# Altium project QUTMS-SHDN-CURRENT-V00.PrjPcb
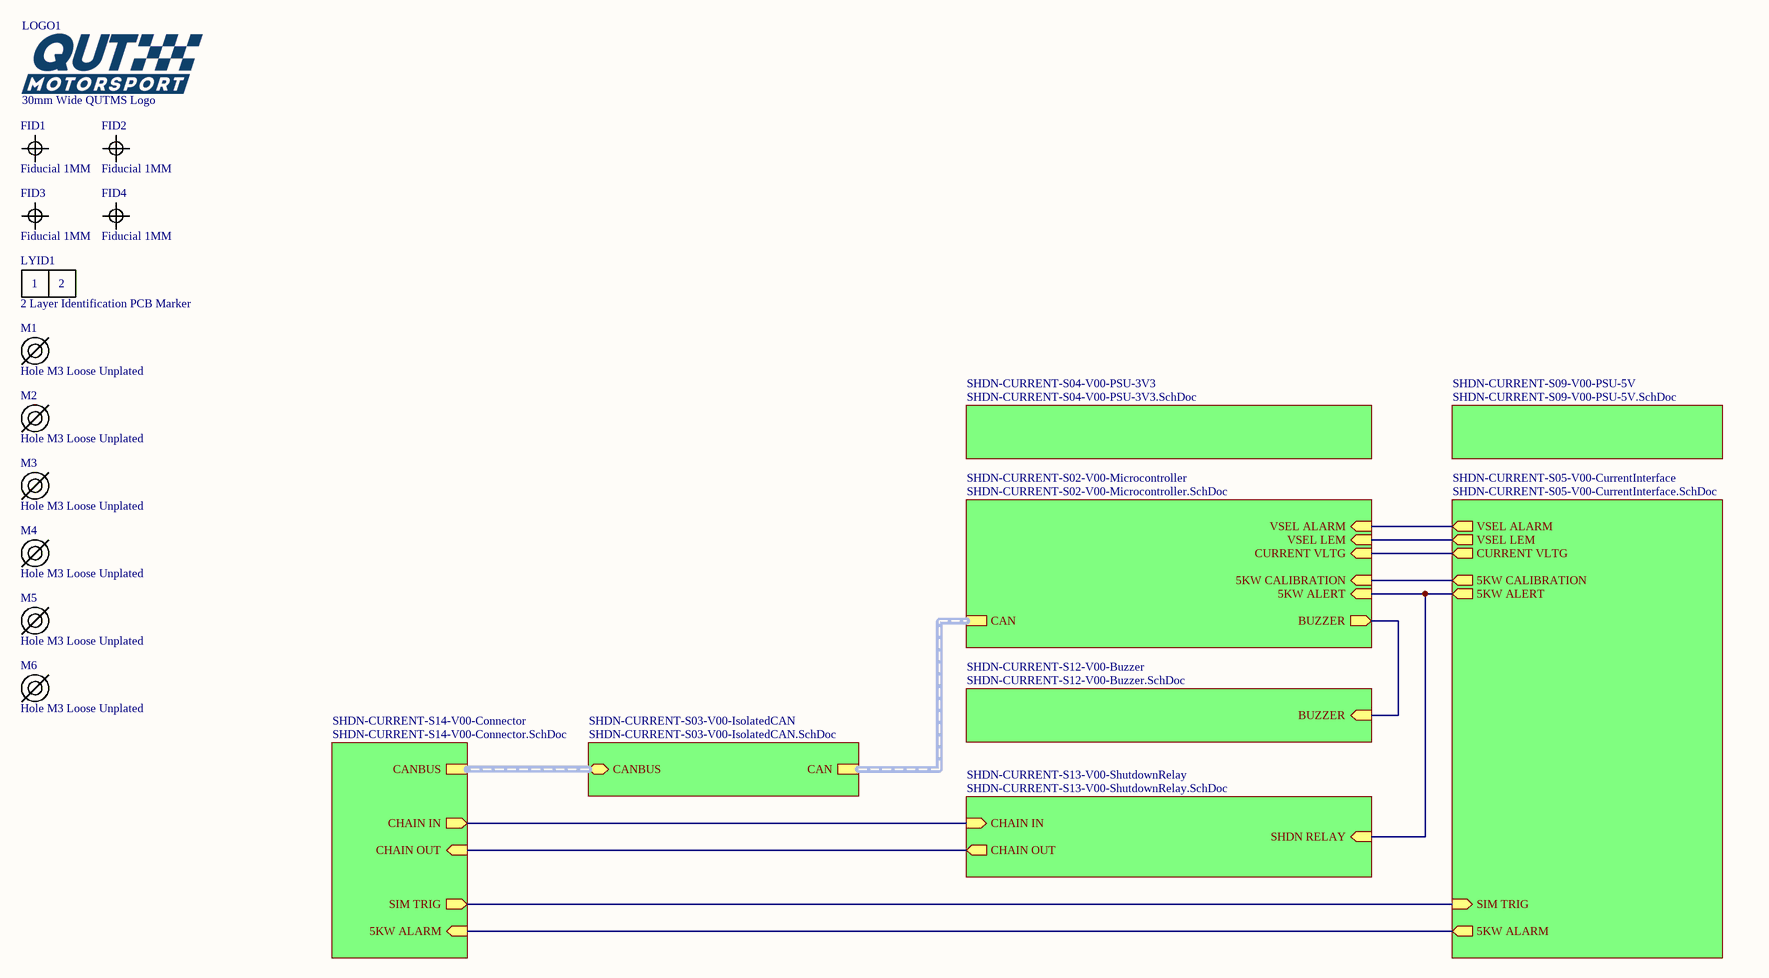
[diagram p0: SHDN-CURRENT-S01-V00-CurrentBoard.SchDoc]
13 sheets, 123 parts. Net scope: hierarchical (ports join the sheet entries above them; power ports are global).
Board file: SHDN-CURRENT-P01-V00.PcbDoc
Sheets:
  SHDN-CURRENT-S01-V00-CurrentBoard.SchDoc
    SHDN-CURRENT-S05-V00-CurrentInterface = SHDN-CURRENT-S05-V00-CurrentInterface.SchDoc
      SHDN-CURRENT-S06-V00-5kWSimulation = SHDN-CURRENT-S06-V00-5kWSimulation.SchDoc
      SHDN-CURRENT-S07-V00-LEMInterface = SHDN-CURRENT-S07-V00-LEMInterface.SchDoc
      SHDN-CURRENT-S10-V00-5kWAlarm = SHDN-CURRENT-S10-V00-5kWAlarm.SchDoc
      SHDN-CURRENT-S08-V00-5kWDetection = SHDN-CURRENT-S08-V00-5kWDetection.SchDoc
    SHDN-CURRENT-S02-V00-Microcontroller = SHDN-CURRENT-S02-V00-Microcontroller.SchDoc
    SHDN-CURRENT-S04-V00-PSU-3V3 = SHDN-CURRENT-S04-V00-PSU-3V3.SchDoc
    SHDN-CURRENT-S03-V00-IsolatedCAN = SHDN-CURRENT-S03-V00-IsolatedCAN.SchDoc
    SHDN-CURRENT-S09-V00-PSU-5V = SHDN-CURRENT-S09-V00-PSU-5V.SchDoc
    SHDN-CURRENT-S12-V00-Buzzer = SHDN-CURRENT-S12-V00-Buzzer.SchDoc
    SHDN-CURRENT-S13-V00-ShutdownRelay = SHDN-CURRENT-S13-V00-ShutdownRelay.SchDoc
    SHDN-CURRENT-S14-V00-Connector = SHDN-CURRENT-S14-V00-Connector.SchDoc

## Sheet SHDN-CURRENT-S01-V00-CurrentBoard.SchDoc: Shutdown System, Current and 5kW Detection Board
size A3; DrawnBy: Jonn Dillon; DocumentNumber: 1; SheetNumber: 1; SheetTotal: 14; Project: Shutdown Current Board 2020

### Parts
FID1  Fiducial 1MM  [FIDUCIAL 1MM]
FID2  Fiducial 1MM  [FIDUCIAL 1MM]
FID3  Fiducial 1MM  [FIDUCIAL 1MM]
FID4  Fiducial 1MM  [FIDUCIAL 1MM]
LOGO1  30mm Wide QUTMS Logo  [QUTMS LOGO 30MM]
LYID1  2 Layer Identification PCB Marker  [LAYER IDENT 2]
M1  Hole M3 Loose Unplated  [M3.5 UNPLATED]
M2  Hole M3 Loose Unplated  [M3.5 UNPLATED]
M3  Hole M3 Loose Unplated  [M3.5 UNPLATED]
M4  Hole M3 Loose Unplated  [M3.5 UNPLATED]
M5  Hole M3 Loose Unplated  [M3.5 UNPLATED]
M6  Hole M3 Loose Unplated  [M3.5 UNPLATED]

### Sub-sheets
SHDN-CURRENT-S02-V00-Microcontroller = SHDN-CURRENT-S02-V00-Microcontroller.SchDoc: 5KW CALIBRATION (in), 5KW ALERT (in), CURRENT VLTG (in), CAN (harness CAN), BUZZER (out), VSEL LEM (in), VSEL ALARM (in)
SHDN-CURRENT-S03-V00-IsolatedCAN = SHDN-CURRENT-S03-V00-IsolatedCAN.SchDoc: CANBUS (bidir, harness CANBUS), CAN (harness CAN)
SHDN-CURRENT-S04-V00-PSU-3V3 = SHDN-CURRENT-S04-V00-PSU-3V3.SchDoc: no entries
SHDN-CURRENT-S05-V00-CurrentInterface = SHDN-CURRENT-S05-V00-CurrentInterface.SchDoc: 5KW ALERT (out), 5KW CALIBRATION (out), CURRENT VLTG (out), SIM TRIG (in), VSEL ALARM (out), VSEL LEM (out), 5KW ALARM (out)
SHDN-CURRENT-S09-V00-PSU-5V = SHDN-CURRENT-S09-V00-PSU-5V.SchDoc: no entries
SHDN-CURRENT-S12-V00-Buzzer = SHDN-CURRENT-S12-V00-Buzzer.SchDoc: BUZZER (in)
SHDN-CURRENT-S13-V00-ShutdownRelay = SHDN-CURRENT-S13-V00-ShutdownRelay.SchDoc: SHDN RELAY (in), CHAIN OUT (out), CHAIN IN (in)
SHDN-CURRENT-S14-V00-Connector = SHDN-CURRENT-S14-V00-Connector.SchDoc: CHAIN OUT (in), CHAIN IN (out), CANBUS (harness CANBUS), SIM TRIG (out), 5KW ALARM (in)

### Nets
5kW ALARM: sheet SHDN-CURRENT-S05-V00-CurrentInterface/5KW ALARM, sheet SHDN-CURRENT-S14-V00-Connector/5KW ALARM
5kW ALERT: sheet SHDN-CURRENT-S05-V00-CurrentInterface/5KW ALERT, sheet SHDN-CURRENT-S02-V00-Microcontroller/5KW ALERT, sheet SHDN-CURRENT-S13-V00-ShutdownRelay/SHDN RELAY
5kW CALIBRATION: sheet SHDN-CURRENT-S05-V00-CurrentInterface/5KW CALIBRATION, sheet SHDN-CURRENT-S02-V00-Microcontroller/5KW CALIBRATION
BUZZER: sheet SHDN-CURRENT-S02-V00-Microcontroller/BUZZER, sheet SHDN-CURRENT-S12-V00-Buzzer/BUZZER
CHAIN IN: sheet SHDN-CURRENT-S13-V00-ShutdownRelay/CHAIN IN, sheet SHDN-CURRENT-S14-V00-Connector/CHAIN IN
CHAIN OUT: sheet SHDN-CURRENT-S13-V00-ShutdownRelay/CHAIN OUT, sheet SHDN-CURRENT-S14-V00-Connector/CHAIN OUT
CURRENT VLTG: sheet SHDN-CURRENT-S05-V00-CurrentInterface/CURRENT VLTG, sheet SHDN-CURRENT-S02-V00-Microcontroller/CURRENT VLTG
SIM TRIG: sheet SHDN-CURRENT-S05-V00-CurrentInterface/SIM TRIG, sheet SHDN-CURRENT-S14-V00-Connector/SIM TRIG
VSEL ALARM: sheet SHDN-CURRENT-S05-V00-CurrentInterface/VSEL ALARM, sheet SHDN-CURRENT-S02-V00-Microcontroller/VSEL ALARM
VSEL LEM: sheet SHDN-CURRENT-S05-V00-CurrentInterface/VSEL LEM, sheet SHDN-CURRENT-S02-V00-Microcontroller/VSEL LEM

### Buses and harness runs
harness sheet SHDN-CURRENT-S02-V00-Microcontroller/CAN = sheet SHDN-CURRENT-S03-V00-IsolatedCAN/CAN
harness sheet SHDN-CURRENT-S03-V00-IsolatedCAN/CANBUS = sheet SHDN-CURRENT-S14-V00-Connector/CANBUS

### Notes on the sheet
- Revision History:
- Sheet Title:
- Rev
- Date
- Description
- Project:
- Size:
- Drawn By:
- A3
- Number:
- Revision:
- Sheet
- Version:
- of
- QUT Motorsport
- O-120, Gardens Point
- 2 George Street
- Brisbane, QLD 4000
- Australia
- Print Date:
- Print Time:
- File Name:
- (in symbol Layer Identification 2) 1; 2

### Library data of the parts
LOGO1 = QUTMS Logo 30mm
LYID1 = Layer Identification 2
M1-M6 = Hole M3 Loose Unplated: M3.5 Hole, No Plating

## Sheet SHDN-CURRENT-S05-V00-CurrentInterface.SchDoc: Current Sensor Circuity
size A3; DrawnBy: Jonn Dillon; DocumentNumber: 4; SheetNumber: 4; SheetTotal: 14; Project: Shutdown Current Board 2020
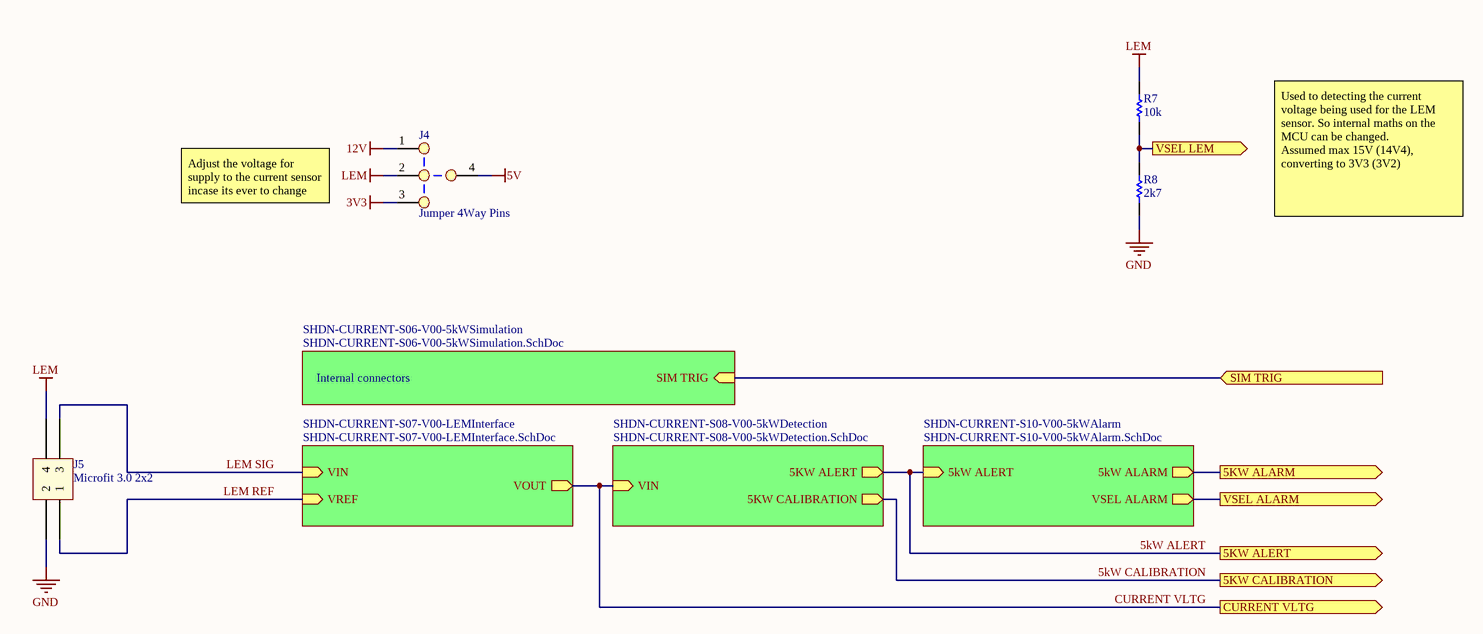
[diagram p1: SHDN-CURRENT-S05-V00-CurrentInterface.SchDoc]

### Parts
J4  Jumper 4Way Pins  [Jumper_4Way_Pin]
J5  Microfit 3.0 2x2  [Microfit_2X2_R_TH]
R7  10k  [Res_ThinFilm_0603]
R8  2k7  [Res_ThinFilm_0603]

### Sub-sheets
SHDN-CURRENT-S06-V00-5kWSimulation = SHDN-CURRENT-S06-V00-5kWSimulation.SchDoc: SIM TRIG (in)
SHDN-CURRENT-S07-V00-LEMInterface = SHDN-CURRENT-S07-V00-LEMInterface.SchDoc: VIN (in), VREF (in), VOUT (out)
SHDN-CURRENT-S08-V00-5kWDetection = SHDN-CURRENT-S08-V00-5kWDetection.SchDoc: 5KW ALERT (out), VIN (in), 5KW CALIBRATION (out)
SHDN-CURRENT-S10-V00-5kWAlarm = SHDN-CURRENT-S10-V00-5kWAlarm.SchDoc: 5kW ALARM (out), 5kW ALERT (in), VSEL ALARM (out)

### Ports
5KW ALARM (out), 5KW ALERT (out), 5KW CALIBRATION (out), CURRENT VLTG (out), SIM TRIG (in), VSEL ALARM (out), VSEL LEM (out)

### Nets
3V3: J4.3
5V: J4.4
12V: J4.1
GND: J5.2 R8.1
LEM: J4.2 J5.4 R7.2
5kW ALARM: port 5KW ALARM, sheet SHDN-CURRENT-S10-V00-5kWAlarm/5kW ALARM
5kW ALERT: port 5KW ALERT, sheet SHDN-CURRENT-S10-V00-5kWAlarm/5kW ALERT, sheet SHDN-CURRENT-S08-V00-5kWDetection/5KW ALERT
5kW CALIBRATION: port 5KW CALIBRATION, sheet SHDN-CURRENT-S08-V00-5kWDetection/5KW CALIBRATION
CURRENT VLTG: port CURRENT VLTG, sheet SHDN-CURRENT-S07-V00-LEMInterface/VOUT, sheet SHDN-CURRENT-S08-V00-5kWDetection/VIN
LEM REF: J5.1 ; sheet SHDN-CURRENT-S07-V00-LEMInterface/VREF
LEM SIG: J5.3 ; sheet SHDN-CURRENT-S07-V00-LEMInterface/VIN
SIM TRIG: port SIM TRIG, sheet SHDN-CURRENT-S06-V00-5kWSimulation/SIM TRIG
VSEL ALARM: port VSEL ALARM, sheet SHDN-CURRENT-S10-V00-5kWAlarm/VSEL ALARM
VSEL LEM: R7.1 R8.2 ; port VSEL LEM

### Notes on the sheet
- Adjust the voltage for supply to the current sensor incase its ever to change
- Used to detecting the current voltage being used for the LEM sensor. So internal maths on the MCU can be changed.
  Assumed max 15V (14V4), converting to 3V3 (3V2)
- Internal connectors
- Revision History:
- Sheet Title:
- Rev
- Date
- Description
- Project:
- Size:
- Drawn By:
- A3
- Number:
- Revision:
- Sheet
- Version:
- of
- QUT Motorsport
- O-120, Gardens Point
- 2 George Street
- Brisbane, QLD 4000
- Australia
- Print Date:
- Print Time:
- File Name:

### Library data of the parts
J5 = Microfit_2x2
R7 = 10k 5% 0603: Resistor, SMD, 10k, 0.1W, 5%, 0603
R8 = 2k7 5% 0603: Resistor, SMD, 2k7, 0.1W, 5%, 0603

## Sheet SHDN-CURRENT-S06-V00-5kWSimulation.SchDoc: 5kW Simulation
size A3; DrawnBy: Jonn Dillon; DocumentNumber: 5; SheetNumber: 5; SheetTotal: 14; Project: Shutdown Current Board 2020
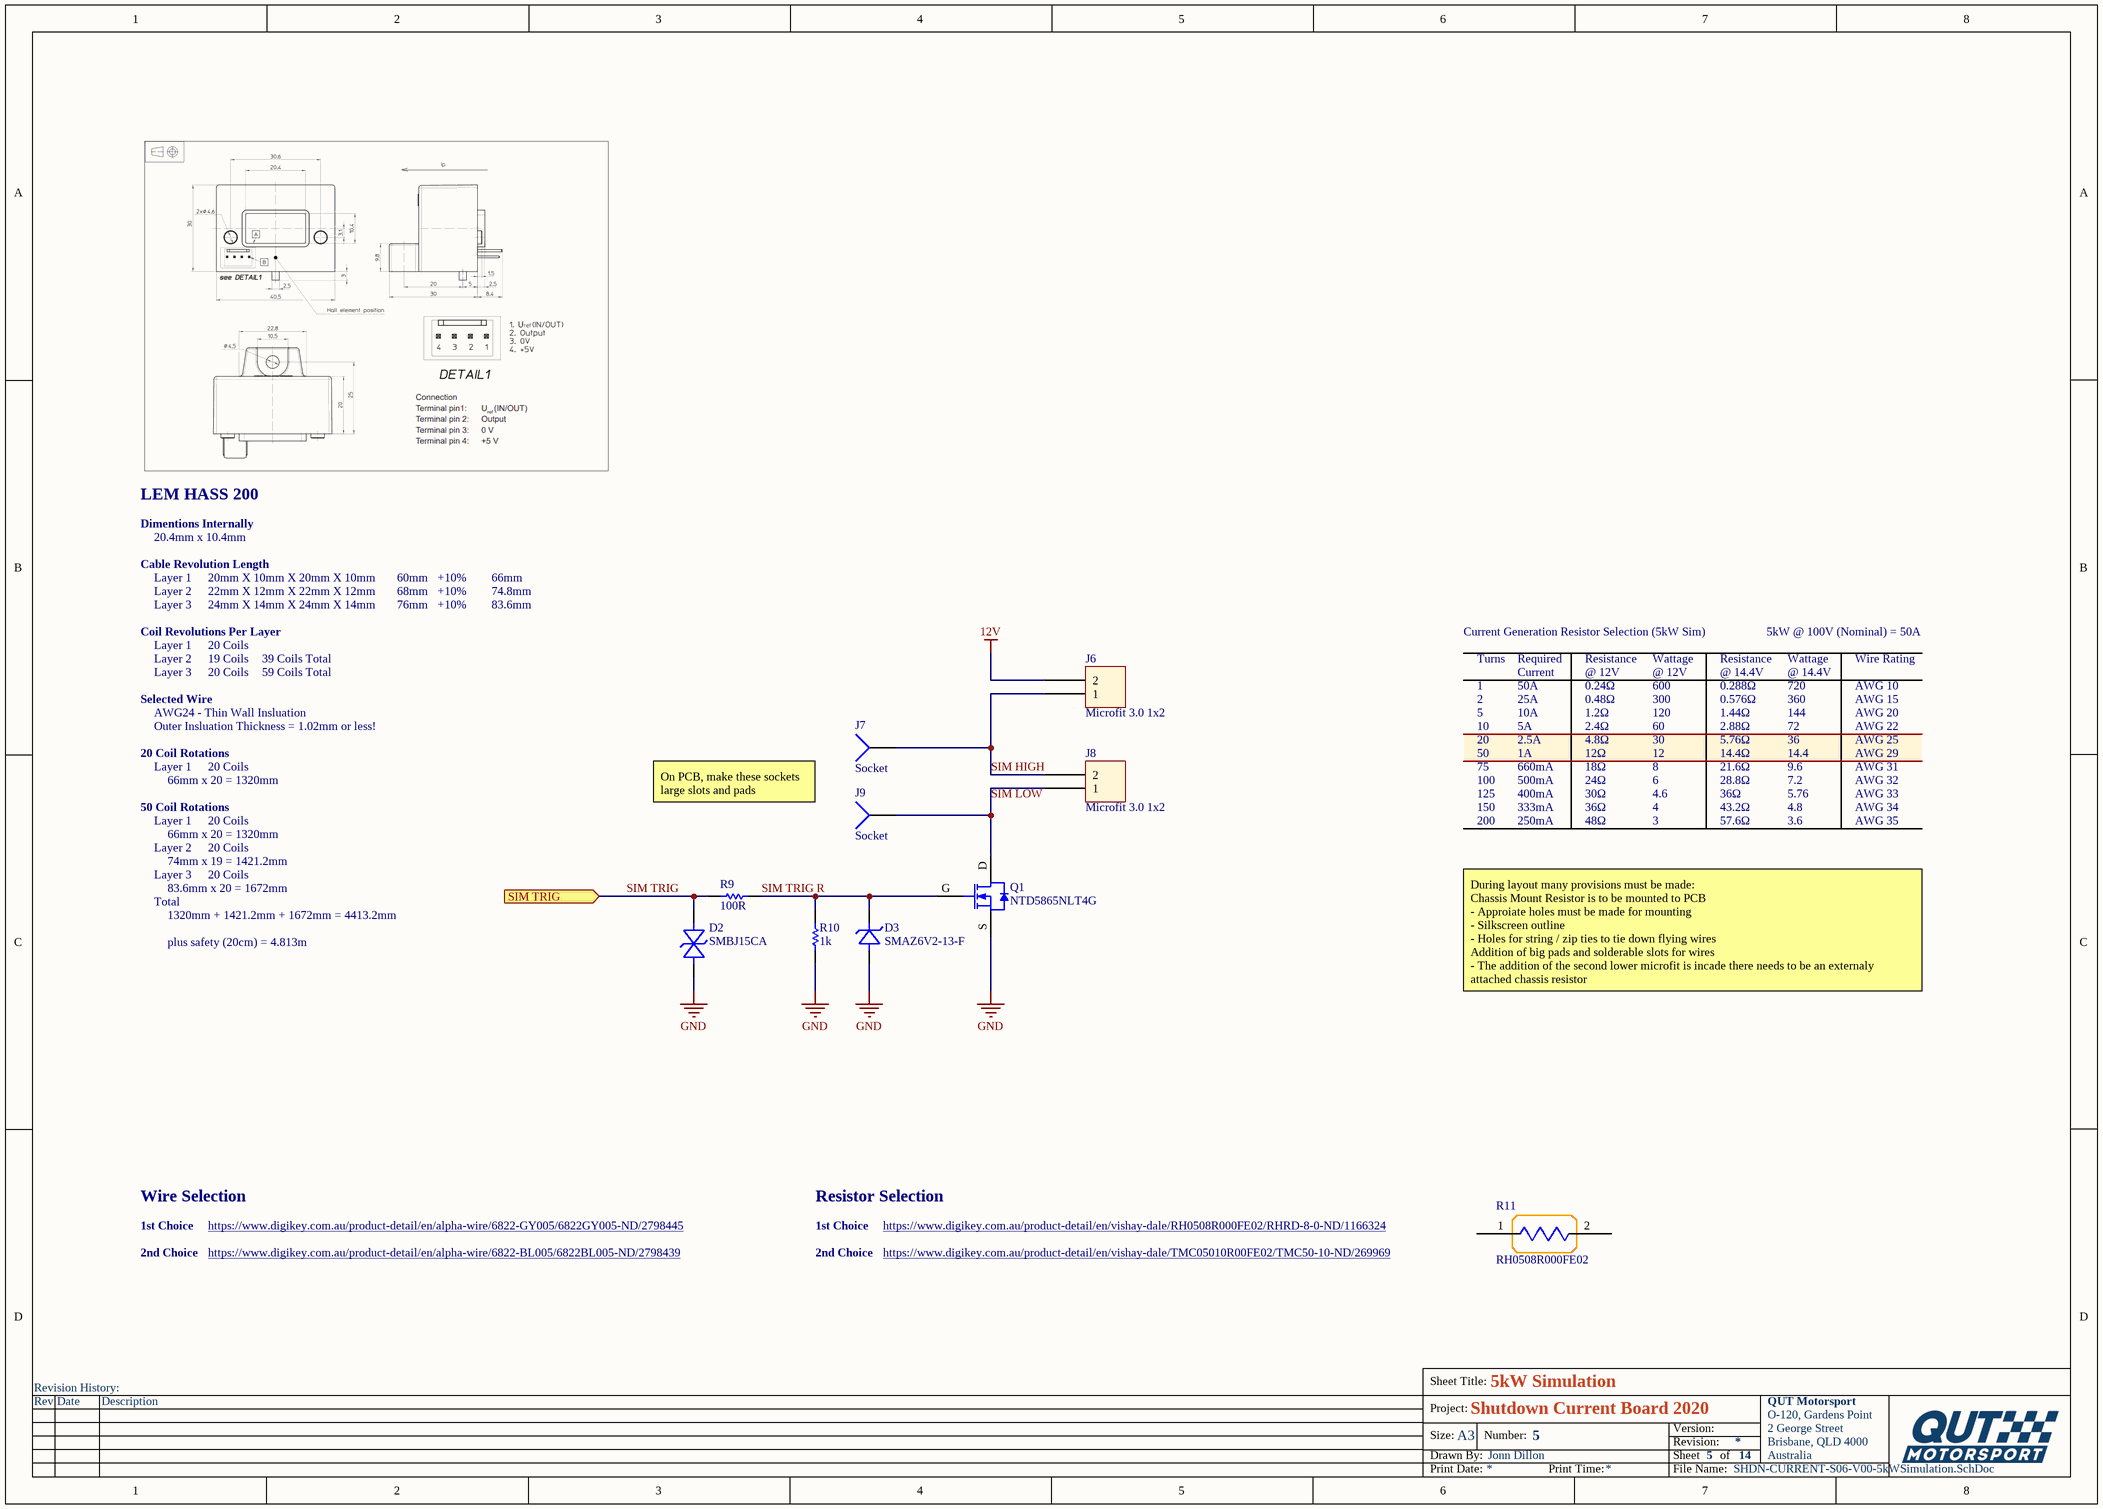
[diagram p2: SHDN-CURRENT-S06-V00-5kWSimulation.SchDoc]

### Parts
D2  SMBJ15CA  [SMB]
D3  SMAZ6V2-13-F  [SMA]
J6  Microfit 3.0 1x2  [Microfit_1X2_R_TH]
J7  Socket  [PIN1]
J8  Microfit 3.0 1x2  [Microfit_1X2_R_TH]
J9  Socket  [PIN1]
Q1  NTD5865NLT4G  [DPAK TO-252]
R9  100R  [Res_ThinFilm_0603]
R10  1k  [Res_ThinFilm_0603]
R11  RH0508R000FE02  [RH0508R000FE02]

### Ports
SIM TRIG (in)

### Nets
12V: J6.2
GND: D2.A(Anode) D3.A(Anode) Q1.S R10.1
SIM HIGH: J6.1 J7.1 J8.2
SIM LOW: J8.1 J9.1 Q1.D
SIM TRIG: D2.K(Cathode) R9.1 ; port SIM TRIG
SIM TRIG R: D3.K(Cathode) Q1.G R9.2 R10.2

Not connected (* = marked no-connect by the designer): R11 1 2

### Notes on the sheet
- LEM HASS 200
- Dimentions Internally
- Cable Revolution Length
- 20.4mm x 10.4mm
- Layer 1
- 20mm X 10mm X 20mm X 10mm
- 60mm
- +10%
- 66mm
- Coil Revolutions Per Layer
- Layer 2
- Layer 3
- 22mm X 12mm X 22mm X 12mm
- 24mm X 14mm X 24mm X 14mm
- 20 Coils
- 68mm
- 76mm
- 74.8mm
- 83.6mm
- Current Generation Resistor Selection (5kW Sim)
- 5kW @ 100V (Nominal) = 50A
- Selected Wire
- AWG24 - Thin Wall Insluation
- 19 Coils
- 39 Coils Total
- 59 Coils Total
- Turns
- 1
- 2
- 5
- Required
- 50A
- 25A
- 10A
- Current
- 0.24Ω
- Resistance
- @ 12V
- 0.48Ω
- 1.2Ω
- 600
- Wattage
- 300
- 120
- @ 14.4V
- 0.288Ω
- 0.576Ω
- 1.44Ω
- 720
- 360
- 144
- Wire Rating
- AWG 10
- AWG 15
- AWG 20
- 20 Coil Rotations
- Outer Insluation Thickness = 1.02mm or less!
- 66mm x 20 = 1320mm
- 10
- 75
- 100
- 20
- 50
- 5A
- 660mA
- 500mA
- 2.5A
- 1A
- 2.4Ω
- 18Ω
- 24Ω
- 4.8Ω
- 12Ω
- 60
- 8
- 6
- 30
- 12
- 2.88Ω
- 21.6Ω
- 28.8Ω
- 5.76Ω
- 14.4Ω
- 72
- 9.6
- 7.2
- 36
- 14.4
- AWG 22
- AWG 31
- AWG 32
- AWG 25
- AWG 29
- 50 Coil Rotations
- On PCB, make these sockets large slots and pads
- 125
- 150
- 200
- 400mA
- 333mA
- 250mA
- 30Ω
- 36Ω
- 48Ω
- 4.6
- 4
- 3
- 43.2Ω
- 57.6Ω
- 5.76
- 4.8
- 3.6
- AWG 33
- AWG 34
- AWG 35
- Total
- 74mm x 19 = 1421.2mm
- 83.6mm x 20 = 1672mm
- 1320mm + 1421.2mm + 1672mm = 4413.2mm
- plus safety (20cm) = 4.813m
- During layout many provisions must be made:
  Chassis Mount Resistor is to be mounted to PCB
  - Approiate holes must be made for mounting
  - Silkscreen outline
  - Holes for string / zip ties to tie down flying wires
  Addition of big pads and solderable slots for wires
  - The addition of the second lower microfit is incade there needs to be an externaly attached chassis resistor
- 1st Choice
- 2nd Choice
- Wire Selection
- https://www.digikey.com.au/product-detail/en/alpha-wire/6822-BL005/6822BL005-ND/2798439
- https://www.digikey.com.au/product-detail/en/alpha-wire/6822-GY005/6822GY005-ND/2798445
- Resistor Selection
- https://www.digikey.com.au/product-detail/en/vishay-dale/TMC05010R00FE02/TMC50-10-ND/269969
- https://www.digikey.com.au/product-detail/en/vishay-dale/RH0508R000FE02/RHRD-8-0-ND/1166324
- Revision History:
- Sheet Title:
- Rev
- Date
- Description
- Project:
- Size:
- Drawn By:
- A3
- Number:
- Revision:
- Sheet
- Version:
- of
- QUT Motorsport
- O-120, Gardens Point
- 2 George Street
- Brisbane, QLD 4000
- Australia
- Print Date:
- Print Time:
- File Name:

### Library data of the parts
D2 = SMBJ15CA: Diode, SMD, TVS Diode, 15V 24.4V, DO214AA/SMB; ComponentLink1Description: Digikey; ComponentLink1URL: https://www.digikey.com.au/product-detail/en/littelfuse-inc/SMBJ15CA/SMBJ15CALFCT-ND/285983; ComponentLink2Description: Datasheet; ComponentLink2URL: https://www.littelfuse.com/~/media/electronics/datasheets/tvs_diodes/littelfuse_tvs_diode_smbj_datasheet.pdf.pdf
D3 = SMAZ6V2-13-F: Zener Diode 6.2V 1W ±5% Surface Mount SMA; Manufacturer: Generic; MPN: 5V6 500mW SMA
J6 J8 = Microfit_1x2
Q1 = NTD5865NLT4G: NTD5865NLT4G, 60V 46A
R9 = 100R 5%, 0603: Resistor, SMD, 100R, 0.1W, 5%, 0603
R10 = 1k 5% 0603: Resistor, SMD, 1k, 0.1W, 5%, 0603
R11 = RH0508R000FE02: 8 Ohms ±1% 50W Wirewound Chassis Mount Resistor; ComponentLink1Description: Digikey; ComponentLink1URL: https://www.digikey.com.au/product-detail/en/vishay-dale/RH0508R000FE02/RHRD-8-0-ND/1166324; ComponentLink2Description: Datasheet; ComponentLink2URL: https://www.vishay.com/docs/30201/rhnh.pdf
J7 J9 = Socket: LatestRevisionDate: 17-Jul-2002; LatestRevisionNote: Re-released for DXP Platform.; Publisher: Altium Limited

## Sheet SHDN-CURRENT-S07-V00-LEMInterface.SchDoc: Current Sensor Interface
size A3; DrawnBy: Jonn Dillon; DocumentNumber: 6; SheetNumber: 6; SheetTotal: 14; Project: Shutdown Current Board 2020
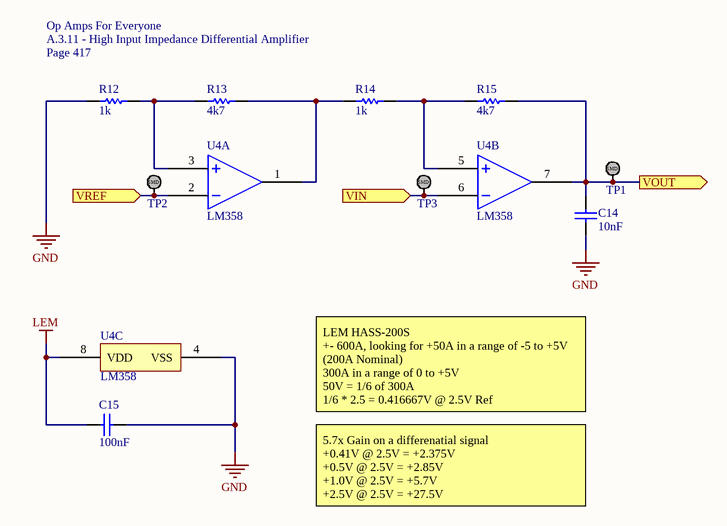
[diagram p3: SHDN-CURRENT-S07-V00-LEMInterface.SchDoc]

### Parts
C14  10nF  [Cap_Ceramic_0603]
C15  100nF  [Cap_Ceramic_0603]
R12  1k  [Res_ThinFilm_0603]
R13  4k7  [Res_ThinFilm_0603]
R14  1k  [Res_ThinFilm_0603]
R15  4k7  [Res_ThinFilm_0603]
TP1  TestPoint_SMD  [TestPointSMD]  (value not drawn)
TP2  TestPoint_SMD  [TestPointSMD]  (value not drawn)
TP3  TestPoint_SMD  [TestPointSMD]  (value not drawn)
U4  LM358  [TSSOP-8]  (parts A,B,C of 3)

### Ports
VIN (in), VOUT (out), VREF (in)

### Nets
GND: C14.1 C15.2 R12.1 U4.4(VSS)
LEM: C15.1 U4.8(VDD)
CURRENT VLTG: C14.2 R15.2 TP1.1 U4.7(OUT1) ; port VOUT
LEM REF: TP2.1 U4.2(IN1-) ; port VREF
LEM SIG: TP3.1 U4.6(IN2-) ; port VIN
NetR12_2: R12.2 R13.1 U4.3(IN1+)
NetR13_2: R13.2 R14.1 U4.1(OUT1)
NetR14_2: R14.2 R15.1 U4.5(IN2+)

### Notes on the sheet
- Op Amps For Everyone
- A.3.11 - High Input Impedance Differential Amplifier
- (near R12) Page 417
- LEM HASS-200S
  +- 600A, looking for +50A in a range of -5 to +5V
  (200A Nominal)
  300A in a range of 0 to +5V
  50V = 1/6 of 300A
  1/6 * 2.5 = 0.416667V @ 2.5V Ref
- 5.7x Gain on a differenatial signal
  +0.41V @ 2.5V = +2.375V
  +0.5V @ 2.5V = +2.85V
  +1.0V @ 2.5V = +5.7V
  +2.5V @ 2.5V = +27.5V
- Revision History:
- Sheet Title:
- Rev
- Date
- Description
- Project:
- Size:
- Drawn By:
- A3
- Number:
- Revision:
- Sheet
- Version:
- of
- QUT Motorsport
- O-120, Gardens Point
- 2 George Street
- Brisbane, QLD 4000
- Australia
- Print Date:
- Print Time:
- File Name:
- (in symbol TestPoint_SMD) SMD

### Library data of the parts
C14 = 10nF 50V 5% X7R 0603: Capacitor, Ceramic, SMD, 10nF, 50V, 5%, X7R, 0603
C15 = 100nF 50V 5% X7R 0603: Capacitor, Ceramic, SMD, 100nF, 50V, 5%, X7R, 0603
R12 R14 = 1k 5% 0603: Resistor, SMD, 1k, 0.1W, 5%, 0603
R13 R15 = 4k7 5% 0603: Resistor, SMD, 4k7, 0.1W, 5%, 0603
U4 = LM358: General Purpose Amplifier 2 Circuit 8-SOIC

## Sheet SHDN-CURRENT-S10-V00-5kWAlarm.SchDoc: 5kW Alarm
size A3; DrawnBy: Jonn Dillon; DocumentNumber: 10; SheetNumber: 10; SheetTotal: 14; Project: Shutdown Current Board 2020
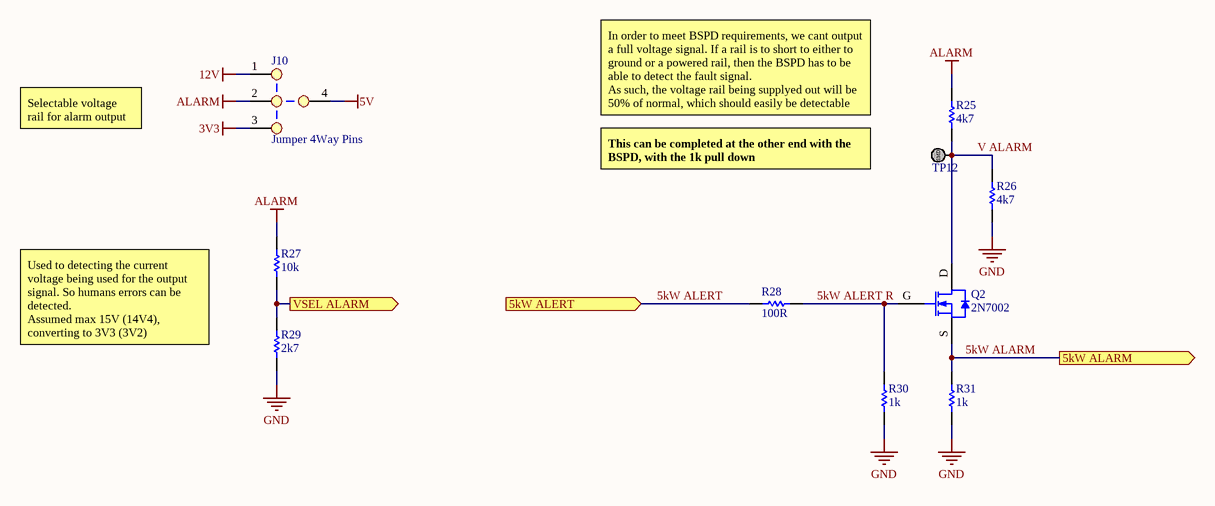
[diagram p4: SHDN-CURRENT-S10-V00-5kWAlarm.SchDoc]

### Parts
J10  Jumper 4Way Pins  [Jumper_4Way_Pin]
Q2  2N7002  [SOT23-3]
R25  4k7  [Res_ThinFilm_0603]
R26  4k7  [Res_ThinFilm_0603]
R27  10k  [Res_ThinFilm_0603]
R28  100R  [Res_ThinFilm_0603]
R29  2k7  [Res_ThinFilm_0603]
R30  1k  [Res_ThinFilm_0603]
R31  1k  [Res_ThinFilm_0603]
TP12  TestPoint_SMD  [TestPointSMD]  (value not drawn)

### Ports
5kW ALARM (out), 5kW ALERT (in), VSEL ALARM (out)

### Nets
3V3: J10.3
5V: J10.4
12V: J10.1
ALARM: J10.2 R25.2 R27.2
GND: R26.1 R29.1 R30.1 R31.1
5kW ALARM: Q2.S R31.2 ; port 5kW ALARM
5kW ALERT: R28.1 ; port 5kW ALERT
5kW ALERT R: Q2.G R28.2 R30.2
V ALARM: Q2.D R25.1 R26.2 TP12.1
VSEL ALARM: R27.1 R29.2 ; port VSEL ALARM

### Notes on the sheet
- In order to meet BSPD requirements, we cant output a full voltage signal. If a rail is to short to either to ground or a powered rail, then the BSPD has to be able to detect the fault signal.
  As such, the voltage rail being supplyed out will be 50% of normal, which should easily be detectable
- Selectable voltage rail for alarm output
- This can be completed at the other end with the BSPD, with the 1k pull down
- Used to detecting the current voltage being used for the output signal. So humans errors can be detected.
  Assumed max 15V (14V4), converting to 3V3 (3V2)
- Revision History:
- Sheet Title:
- Rev
- Date
- Description
- Project:
- Size:
- Drawn By:
- A3
- Number:
- Revision:
- Sheet
- Version:
- of
- QUT Motorsport
- O-120, Gardens Point
- 2 George Street
- Brisbane, QLD 4000
- Australia
- Print Date:
- Print Time:
- File Name:
- (in symbol TestPoint_SMD) SMD

### Library data of the parts
R25 R26 = 4k7 5% 0603: Resistor, SMD, 4k7, 0.1W, 5%, 0603
R27 = 10k 5% 0603: Resistor, SMD, 10k, 0.1W, 5%, 0603
R28 = 100R 5%, 0603: Resistor, SMD, 100R, 0.1W, 5%, 0603
R29 = 2k7 5% 0603: Resistor, SMD, 2k7, 0.1W, 5%, 0603
R30 R31 = 1k 5% 0603: Resistor, SMD, 1k, 0.1W, 5%, 0603

## Sheet SHDN-CURRENT-S08-V00-5kWDetection.SchDoc: 5kW Detection / Comparison
size A3; DrawnBy: Jonn Dillon; DocumentNumber: 7; SheetNumber: 7; SheetTotal: 14; Project: Shutdown Current Board 2020
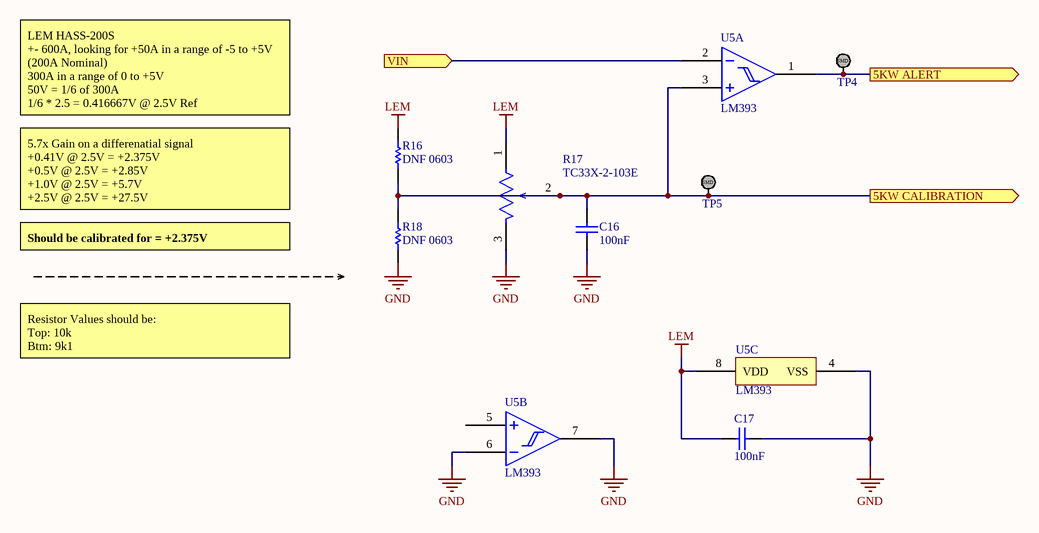
[diagram p5: SHDN-CURRENT-S08-V00-5kWDetection.SchDoc]

### Parts
C16  100nF  [Cap_Ceramic_0603]
C17  100nF  [Cap_Ceramic_0603]
R16  DNF 0603  [Res_ThinFilm_0603]
R17  TC33X-2-103E  [TC33]
R18  DNF 0603  [Res_ThinFilm_0603]
TP4  TestPoint_SMD  [TestPointSMD]  (value not drawn)
TP5  TestPoint_SMD  [TestPointSMD]  (value not drawn)
U5  LM393  [TSSOP-8]  (parts A,B,C of 3)

### Ports
5KW ALERT (out), 5KW CALIBRATION (out), VIN (in)

### Nets
GND: C16.1 C17.2 R17.3 R18.1 U5.4(VSS) U5.6(IN2-) U5.7(OUT1)
LEM: C17.1 R16.2 R17.1 U5.8(VDD)
5kW ALERT: TP4.1 U5.1(OUT1) ; port 5KW ALERT
5kW CALIBRATION: C16.2 R16.1 R17.2 R18.2 TP5.1 U5.3(IN1+) ; port 5KW CALIBRATION
CURRENT VLTG: U5.2(IN1-) ; port VIN

Not connected (* = marked no-connect by the designer): U5 5(IN2+)

### Notes on the sheet
- LEM HASS-200S
  +- 600A, looking for +50A in a range of -5 to +5V
  (200A Nominal)
  300A in a range of 0 to +5V
  50V = 1/6 of 300A
  1/6 * 2.5 = 0.416667V @ 2.5V Ref
- 5.7x Gain on a differenatial signal
  +0.41V @ 2.5V = +2.375V
  +0.5V @ 2.5V = +2.85V
  +1.0V @ 2.5V = +5.7V
  +2.5V @ 2.5V = +27.5V
- Should be calibrated for = +2.375V
- Resistor Values should be:
  Top: 10k
  Btm: 9k1
- Revision History:
- Sheet Title:
- Rev
- Date
- Description
- Project:
- Size:
- Drawn By:
- A3
- Number:
- Revision:
- Sheet
- Version:
- of
- QUT Motorsport
- O-120, Gardens Point
- 2 George Street
- Brisbane, QLD 4000
- Australia
- Print Date:
- Print Time:
- File Name:
- (in symbol TestPoint_SMD) SMD

### Library data of the parts
C16 C17 = 100nF 50V 5% X7R 0603: as C15 on sheet SHDN-CURRENT-S07-V00-LEMInterface
R16 R18 = DNF 0603: Resistor, SMD, DNF, 0.1W, 0603
R17 = TC33X-2-103E: 10 kOhms 0.1W, 1/10W J Lead Surface Mount Trimmer Potentiometer Cermet 1 Turn Top Adjustment
U5 = LM393: General Purpose Comparitor 2 Circuit 8-SOIC

## Sheet SHDN-CURRENT-S02-V00-Microcontroller.SchDoc: Microcontroller
size A3; DrawnBy: Jonn DIllon; DocumentNumber: 2; Revision: 01; SheetNumber: 2; SheetTotal: 14; Version: 01; Project: Shutdown Current Board 2020; PageSetup: Record=PageOptions|CenterHorizontal=True|CenterVertical=True|PrintScale=0.97|XCorrection=1.00|YCorrection=1.00|PrintKind=0|BorderSize=5000000|LeftOffset=0|BottomOffset=0|Orientation=2|PaperLength=1000|PaperWidth=1000|Scale=100|PaperSource=7|PrintQuality=-4|MediaType=1|DitherType=10|PaperKind=A4|PrintScaleMode=1
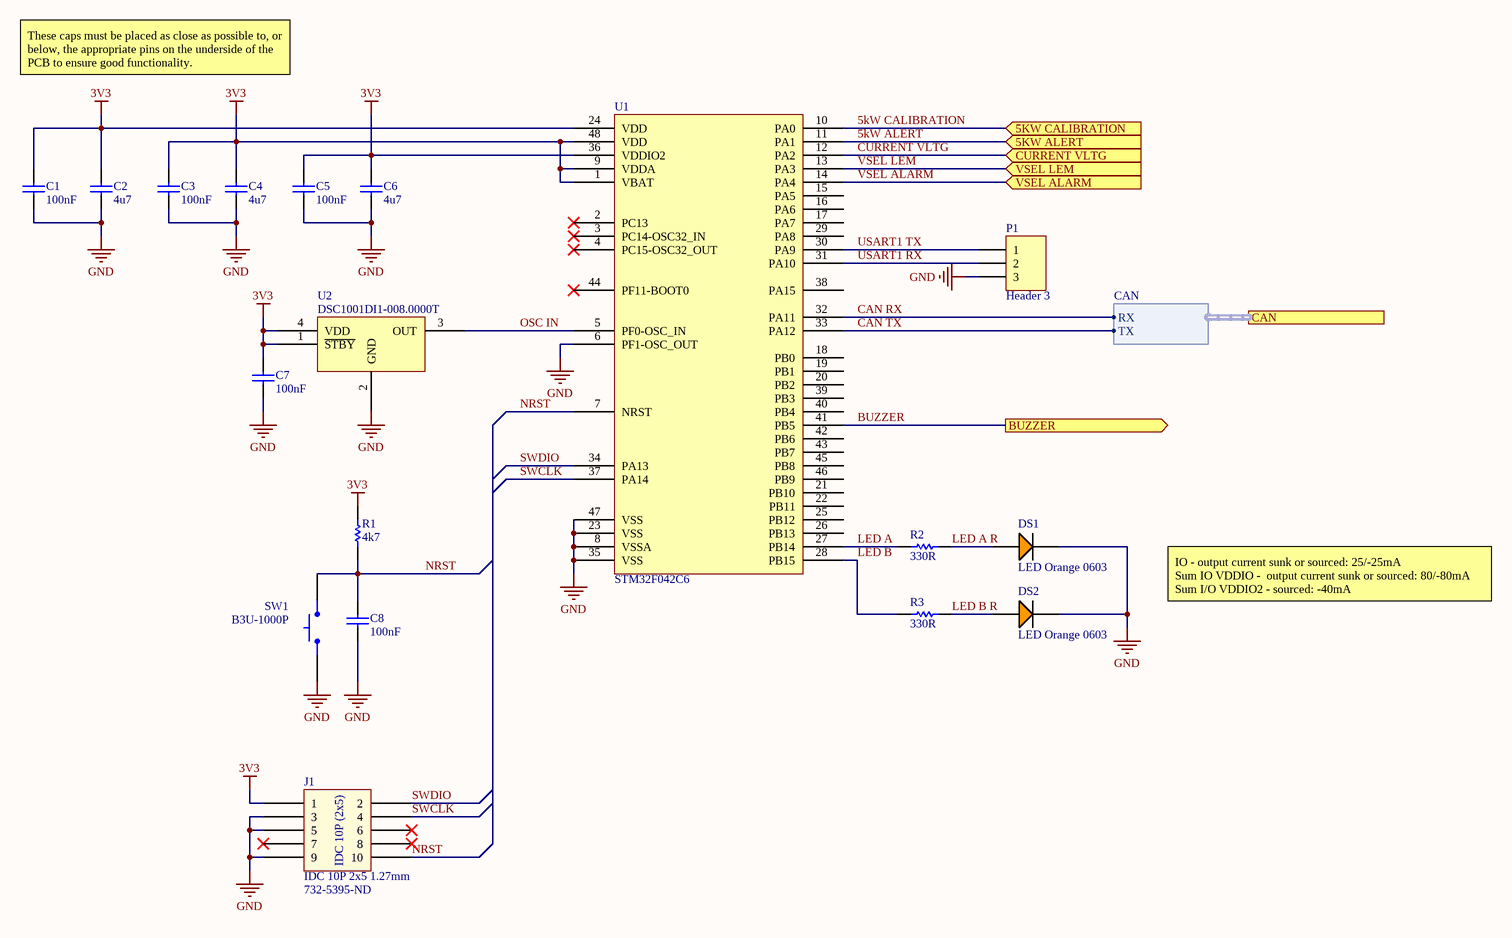
[diagram p6: SHDN-CURRENT-S02-V00-Microcontroller.SchDoc]

### Parts
C1  100nF  [Cap_Ceramic_0603]
C2  4u7  [Cap_Ceramic_0603]
C3  100nF  [Cap_Ceramic_0603]
C4  4u7  [Cap_Ceramic_0603]
C5  100nF  [Cap_Ceramic_0603]
C6  4u7  [Cap_Ceramic_0603]
C7  100nF  [Cap_Ceramic_0603]
C8  100nF  [Cap_Ceramic_0603]
DS1  LED Orange 0603  [LED ORANGE 0603]
DS2  LED Orange 0603  [LED ORANGE 0603]
J1  IDC 10P 2x5 1.27mm  [IDC 1.27MM 10P]
P1  Header 3  [HDR1X3]
R1  4k7  [Res_ThinFilm_0603]
R2  330R  [Res_ThinFilm_0603]
R3  330R  [Res_ThinFilm_0603]
SW1  B3U-1000P  [BTN B3U-1000P]
U1  STM32F042C6  [STM32F042C6]
U2  DSC1001DI1-008.0000T  [DSC1001DI1-008.0000TCT-ND]

### Ports
5KW ALERT (in), 5KW CALIBRATION (in), BUZZER (out), CAN (harness CAN), CURRENT VLTG (in), VSEL ALARM (in), VSEL LEM (in)

### Harnesses
CAN: RX, TX

### Nets
3V3: C1.2 C2.2 C3.2 C4.2 C5.2 C6.2 C7.2 J1.1 R1.2 U1.1(VBAT) U1.9(VDDA) U1.24(VDD) U1.36(VDDIO2) U1.48(VDD) U2.1(~{STBY}) U2.4(VDD)
GND: C1.1 C2.1 C3.1 C4.1 C5.1 C6.1 C7.1 C8.1 DS1.2(C) DS2.2(C) J1.3 J1.5 J1.9 P1.3 SW1.1 U1.6(PF1-OSC_OUT) U1.8(VSSA) U1.23(VSS) U1.35(VSS) U1.47(VSS) U2.2(GND)
5kW ALERT: U1.11(PA1) ; port 5KW ALERT
5kW CALIBRATION: U1.10(PA0) ; port 5KW CALIBRATION
BUZZER: U1.41(PB5) ; port BUZZER
CAN RX: U1.32(PA11) ; port CAN.RX
CAN TX: U1.33(PA12) ; port CAN.TX
CURRENT VLTG: U1.12(PA2) ; port CURRENT VLTG
LED A: R2.1 U1.27(PB14)
LED A R: DS1.1(A) R2.2
LED B: R3.1 U1.28(PB15)
LED B R: DS2.1(A) R3.2
NRST: C8.2 J1.10 R1.1 SW1.2 U1.7(NRST)
OSC IN: U1.5(PF0-OSC_IN) U2.3(OUT)
SWCLK: J1.4 U1.37(PA14)
SWDIO: J1.2 U1.34(PA13)
USART1 RX: P1.2 U1.31(PA10)
USART1 TX: P1.1 U1.30(PA9)
VSEL ALARM: U1.14(PA4) ; port VSEL ALARM
VSEL LEM: U1.13(PA3) ; port VSEL LEM

Not connected (* = marked no-connect by the designer): J1 6* 7* 8*; U1 2(PC13)* 3(PC14-OSC32_IN)* 4(PC15-OSC32_OUT)* 15(PA5) 16(PA6) 17(PA7) 18(PB0) 19(PB1) 20(PB2) 21(PB10) 22(PB11) 25(PB12) 26(PB13) 29(PA8) 38(PA15) 39(PB3) 40(PB4) 42(PB6) 43(PB7) 44(PF11-BOOT0)* 45(PB8) 46(PB9)

### Notes on the sheet
- These caps must be placed as close as possible to, or below, the appropriate pins on the underside of the PCB to ensure good functionality.
- IO - output current sunk or sourced: 25/-25mA
  Sum IO VDDIO -  output current sunk or sourced: 80/-80mA
  Sum I/O VDDIO2 - sourced: -40mA
- (near J1) 732-5395-ND
- Revision History:
- Sheet Title:
- Rev
- Date
- Description
- Project:
- Size:
- Drawn By:
- A3
- Number:
- Revision:
- Sheet
- Version:
- of
- QUT Motorsport
- O-120, Gardens Point
- 2 George Street
- Brisbane, QLD 4000
- Australia
- Print Date:
- Print Time:
- File Name:
- (in symbol IDC 10P 2x5 1.27mm) IDC 10P (2x5)

### Library data of the parts
C1 C3 C5 C7 C8 = 100nF 50V 5% X7R 0603: as C15 on sheet SHDN-CURRENT-S07-V00-LEMInterface
C2 C4 C6 = 4u7 50V 5% X7R 0603: Capacitor, Ceramic, SMD, 4u7, 50V, 5%, X7R, 0603
P1 = Header 3: Header, 3-Pin; LatestRevisionDate: 17-Jul-2002; LatestRevisionNote: Re-released for DXP Platform.; Publisher: Altium Limited
R1 = 4k7 5% 0603: Resistor, SMD, 4k7, 0.1W, 5%, 0603
R2 R3 = 330R 5% 0603: Resistor, SMD, 330R, 0.1W, 5%, 0603
SW1 = BTN B3U-1000P: Omron B3U-1000P Ultra Miniture Switch; ComponentLink1Description: LCSC; ComponentLink1URL: https://lcsc.com/product-detail/Tactile-Switches_BRIGHT-TSA063G50-250_C294565.html
U1 = STM32F042C6: ARM® Cortex®-M0 STM32F0 Microcontroller IC 32-Bit 48MHz 32KB (32K x 8) FLASH 48-LQFP (7x7); ComponentLink1Description: Digikey; ComponentLink1URL: https://www.digikey.com.au/product-detail/en/stmicroelectronics/STM32F042C6T6TR/497-19319-1-ND/10063344; ComponentLink2Description: Datasheet; ComponentLink2URL: https://www.st.com/resource/en/datasheet/stm32f042k6.pdf
U2 = DSC1001DI1-008.0000T: on 8MHz XO (Standard) CMOS Oscillator 1.8 ~ 3.3V Standby (Power Down) 4-SMD, No Lead

## Sheet SHDN-CURRENT-S04-V00-PSU-3V3.SchDoc: Power Supply (9-25V to 3v3 @ 0.1-0.3A)
size A3; DrawnBy: Jonn Dillon; DocumentNumber: 8; Revision: 01; SheetNumber: 8; SheetTotal: 14; Version: 01; Project: Shutdown Current Board 2020; PageSetup: Record=PageOptions|CenterHorizontal=True|CenterVertical=True|PrintScale=0.97|XCorrection=1.00|YCorrection=1.00|PrintKind=0|BorderSize=5000000|LeftOffset=0|BottomOffset=0|Orientation=2|PaperLength=1000|PaperWidth=1000|Scale=100|PaperSource=7|PrintQuality=-4|MediaType=1|DitherType=10|PaperKind=A4|PrintScaleMode=1
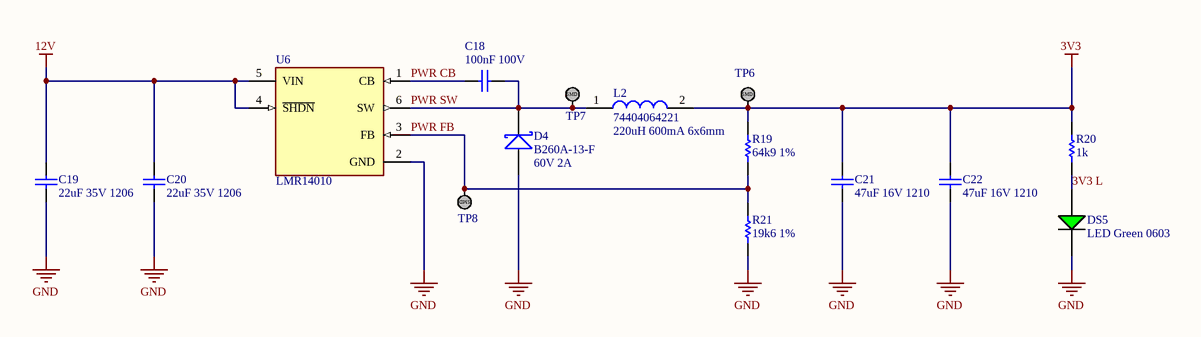
[diagram p7: SHDN-CURRENT-S04-V00-PSU-3V3.SchDoc]

### Parts
C18  100nF 100V  [Cap_Ceramic_0603]
C19  22uF 35V 1206  [Cap_Ceramic_1206]
C20  22uF 35V 1206  [Cap_Ceramic_1206]
C21  47uF 16V 1210  [Cap_Ceramic_1210]
C22  47uF 16V 1210  [Cap_Ceramic_1210]
D4  B260A-13-F  [SMA]
DS5  LED Green 0603  [LED GREEN 0603]
L2  74404064221  [Inductor_6x6mm]
R19  64k9 1%  [Res_ThinFilm_0603]
R20  1k  [Res_ThinFilm_0603]
R21  19k6 1%  [Res_ThinFilm_0603]
TP6  TestPoint_SMD  [TestPointSMD]  (value not drawn)
TP7  TestPoint_SMD  [TestPointSMD]  (value not drawn)
TP8  TestPoint_SMD  [TestPointSMD]  (value not drawn)
U6  LMR14010  [LMR14010]

### Nets
3V3: C21.2 C22.2 L2.2 R19.2 R20.2 TP6.1
12V: C19.2 C20.2 U6.4(~{SHDN}) U6.5(VIN)
GND: C19.1 C20.1 C21.1 C22.1 D4.A DS5.2(C) R21.1 U6.2(GND)
3V3 L: DS5.1(A) R20.1
PWR CB: C18.1 U6.1(CB)
PWR FB: R19.1 R21.2 TP8.1 U6.3(FB)
PWR SW: C18.2 D4.K L2.1 TP7.1 U6.6(SW)

### Notes on the sheet
- (near L2) 220uH 600mA 6x6mm
- (near D4) 60V 2A
- Revision History:
- Sheet Title:
- Rev
- Date
- Description
- Project:
- Size:
- Drawn By:
- A3
- Number:
- Revision:
- Sheet
- Version:
- of
- QUT Motorsport
- O-120, Gardens Point
- 2 George Street
- Brisbane, QLD 4000
- Australia
- Print Date:
- Print Time:
- File Name:
- (in symbol TestPoint_SMD) SMD

### Library data of the parts
C18 = 100nF 100V 5% X7R 0603: Capacitor, Ceramic, SMD, 100nF, 100V, 5%, X7R, 0603
C19 C20 = 22uF 35V 10% X7R 1206: Capacitor, Ceramic, SMD, 22uF, 35V, 10%, X7R, 1206
C21 C22 = 47uF 16V 10% X7R 1210: Capacitor, Ceramic, SMD, 47uF, 16V, 5%, X7R, 1210
D4 = B260A-13-F: Diode, Schottky Barrier Rectifier, 60 V, 2 A, B260A-13-F
L2 = 74404064221: FIXED IND 220UH 660MA 850 MOHM; ComponentLink1Description: Digikey; ComponentLink1URL: https://www.digikey.com.au/product-detail/en/w%C3%BCrth-elektronik/74404064221/732-7261-1-ND/5353241; ComponentLink2Description: LCSC A; ComponentLink2URL: https://lcsc.com/product-detail/Power-Inductors_Sunlord-SWPA6045S221MT_C91047.html; ComponentLink3Description: LCSC B; ComponentLink3URL: https://lcsc.com/product-detail/Power-Inductors_SXN-Shun-Xiang-Nuo-Elec-SMNR6045-221MT_C467145.html
R19 = 64k9 1% 0603: Resistor, SMD, 64k9, 0.1W, 5%, 0603
R20 = 1k 5% 0603: Resistor, SMD, 1k, 0.1W, 5%, 0603
R21 = 19k6 1% 0603: Resistor, SMD, 19k6, 0.1W, 5%, 0603

## Sheet SHDN-CURRENT-S03-V00-IsolatedCAN.SchDoc: Isolated CANBUS @ 3V3
size A3; DrawnBy: Jonn Dillon; DocumentNumber: 3; Revision: 01; SheetNumber: 3; SheetTotal: 14; Version: 01; Project: Shutdown Current Board 2020; PageSetup: Record=PageOptions|CenterHorizontal=True|CenterVertical=True|PrintScale=0.97|XCorrection=1.00|YCorrection=1.00|PrintKind=0|BorderSize=5000000|LeftOffset=0|BottomOffset=0|Orientation=2|PaperLength=1000|PaperWidth=1000|Scale=100|PaperSource=7|PrintQuality=-4|MediaType=1|DitherType=10|PaperKind=A4|PrintScaleMode=1
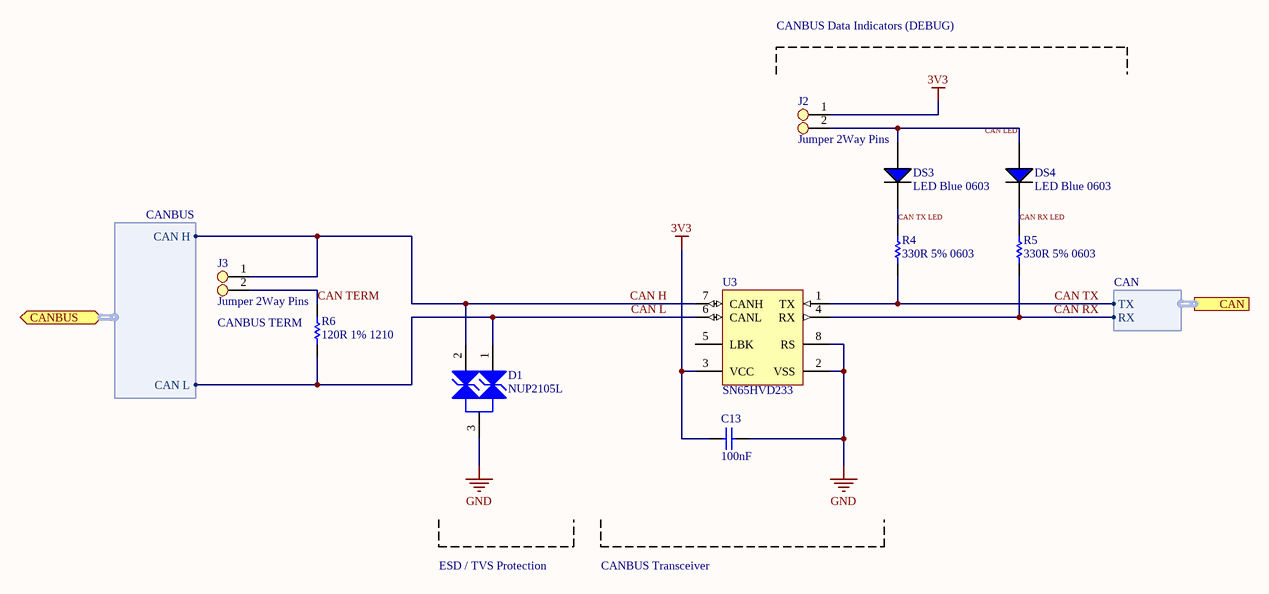
[diagram p8: SHDN-CURRENT-S03-V00-IsolatedCAN.SchDoc]

### Parts
C13  100nF  [Cap_Ceramic_0603]
D1  NUP2105L  [NUP2105L]
DS3  LED Blue 0603  [LED BLUE 0603]
DS4  LED Blue 0603  [LED BLUE 0603]
J2  Jumper 2Way Pins  [Jumper_2Way_Pin]
J3  Jumper 2Way Pins  [Jumper_2Way_Pin]
R4  330R 5% 0603  [Res_ThinFilm_0603]
R5  330R 5% 0603  [Res_ThinFilm_0603]
R6  120R 1% 1210  [Res_ThinFilm_1210]
U3  SN65HVD233  [SN65HVD233DR]

### Ports
CAN (harness CAN), CANBUS (bidir, harness CANBUS)

### Harnesses
CANBUS: CAN H, CAN L
CAN: RX, TX

### Nets
3V3: C13.2 J2.1 U3.3(VCC)
GND: C13.1 D1.3 U3.2(VSS) U3.8(RS)
CAN H: D1.2 J3.1 U3.7(CANH) ; port CANBUS.CAN H
CAN L: D1.1 R6.1 U3.6(CANL) ; port CANBUS.CAN L
CAN LED: DS3.1(A) DS4.1(A) J2.2
CAN RX: R5.1 U3.4(RX) ; port CAN.RX
CAN RX LED: DS4.2(C) R5.2
CAN TERM: J3.2 R6.2
CAN TX: R4.1 U3.1(TX) ; port CAN.TX
CAN TX LED: DS3.2(C) R4.2

Not connected (* = marked no-connect by the designer): U3 5(LBK)

### Notes on the sheet
- CANBUS Data Indicators (DEBUG)
- (near R6) CANBUS TERM
- ESD / TVS Protection
- CANBUS Transceiver
- Revision History:
- Sheet Title:
- Rev
- Date
- Description
- Project:
- Size:
- Drawn By:
- A3
- Number:
- Revision:
- Sheet
- Version:
- of
- QUT Motorsport
- O-120, Gardens Point
- 2 George Street
- Brisbane, QLD 4000
- Australia
- Print Date:
- Print Time:
- File Name:

### Library data of the parts
C13 = 100nF 50V 5% X7R 0603: as C15 on sheet SHDN-CURRENT-S07-V00-LEMInterface
J2 J3 = Jumper 2Way Side Pins
R4 R5 = 330R 5% 0603: Resistor, SMD, 330R, 0.1W, 5%, 0603
R6 = 120R 1% 1210: Resistor, SMD, 120R, 0.25W, 1%, 1210
D1 = NUP2105L: ComponentLink1Description: Datasheet; ComponentLink1URL: https://www.onsemi.cn/PowerSolutions/document/NUP2105L-D.PDF; Parameter 1: *; ComponentLink2Description: LCSC; ComponentLink2URL: https://lcsc.com/product-detail/TVS_ON-Semiconductor-NUP2105LT1G_C14486.html; ComponentLink3Description: Digikey; ComponentLink3URL: https://www.digikey.com.au/product-detail/en/on-semiconductor/SZNUP2105LT1G/SZNUP2105LT1GOSCT-ND/3487669
U3 = SN65HVD233: ComponentLink1Description: LCSC; ComponentLink1URL: https://lcsc.com/product-detail/CAN-ICs_Texas-Instruments_SN65HVD233DRG4_Texas-Instruments-Texas-Instruments-SN65HVD233DRG4_C61643.html; ComponentLink2Description: Digikey; ComponentLink2URL: https://www.digikey.com.au/product-detail/en/texas-instruments/SN65HVD233DR/296-35967-1-ND/4134960; ComponentLink3Description: Datasheet; ComponentLink3URL: https://www.ti.com/lit/ds/symlink/sn65hvd233.pdf?ts=1588560888178; ComponentLink4Description: Ti Product Page; ComponentLink4URL: https://www.ti.com/product/SN65HVD233

## Sheet SHDN-CURRENT-S09-V00-PSU-5V.SchDoc: Power Supply (9-25V to 5V @ 0.1-0.3A)
size A3; DrawnBy: Jonn Dillon; DocumentNumber: 9; Revision: 01; SheetNumber: 9; SheetTotal: 14; Version: 01; Project: Shutdown Current Board 2020; PageSetup: Record=PageOptions|CenterHorizontal=True|CenterVertical=True|PrintScale=0.97|XCorrection=1.00|YCorrection=1.00|PrintKind=0|BorderSize=5000000|LeftOffset=0|BottomOffset=0|Orientation=2|PaperLength=1000|PaperWidth=1000|Scale=100|PaperSource=7|PrintQuality=-4|MediaType=1|DitherType=10|PaperKind=A4|PrintScaleMode=1
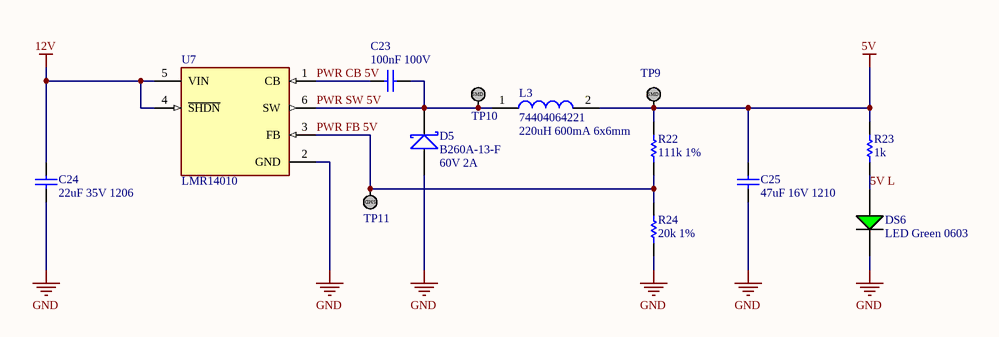
[diagram p9: SHDN-CURRENT-S09-V00-PSU-5V.SchDoc]

### Parts
C23  100nF 100V  [Cap_Ceramic_0603]
C24  22uF 35V 1206  [Cap_Ceramic_1206]
C25  47uF 16V 1210  [Cap_Ceramic_1210]
D5  B260A-13-F  [SMA]
DS6  LED Green 0603  [LED GREEN 0603]
L3  74404064221  [Inductor_6x6mm]
R22  111k 1%  [Res_ThinFilm_0603]
R23  1k  [Res_ThinFilm_0603]
R24  20k 1%  [Res_ThinFilm_0603]
TP9  TestPoint_SMD  [TestPointSMD]  (value not drawn)
TP10  TestPoint_SMD  [TestPointSMD]  (value not drawn)
TP11  TestPoint_SMD  [TestPointSMD]  (value not drawn)
U7  LMR14010  [LMR14010]

### Nets
5V: C25.2 L3.2 R22.2 R23.2 TP9.1
12V: C24.2 U7.4(~{SHDN}) U7.5(VIN)
GND: C24.1 C25.1 D5.A DS6.2(C) R24.1 U7.2(GND)
5V L: DS6.1(A) R23.1
PWR CB 5V: C23.1 U7.1(CB)
PWR FB 5V: R22.1 R24.2 TP11.1 U7.3(FB)
PWR SW 5V: C23.2 D5.K L3.1 TP10.1 U7.6(SW)

### Notes on the sheet
- (near L3) 220uH 600mA 6x6mm
- (near D5) 60V 2A
- Revision History:
- Sheet Title:
- Rev
- Date
- Description
- Project:
- Size:
- Drawn By:
- A3
- Number:
- Revision:
- Sheet
- Version:
- of
- QUT Motorsport
- O-120, Gardens Point
- 2 George Street
- Brisbane, QLD 4000
- Australia
- Print Date:
- Print Time:
- File Name:
- (in symbol TestPoint_SMD) SMD

### Library data of the parts
C23 = 100nF 100V 5% X7R 0603: as C18 on sheet SHDN-CURRENT-S04-V00-PSU-3V3
C24 = 22uF 35V 10% X7R 1206: as C19 on sheet SHDN-CURRENT-S04-V00-PSU-3V3
C25 = 47uF 16V 10% X7R 1210: as C21 on sheet SHDN-CURRENT-S04-V00-PSU-3V3
D5 = B260A-13-F: as D4 on sheet SHDN-CURRENT-S04-V00-PSU-3V3
L3 = 74404064221: FIXED IND 220UH 660MA 850 MOHM; ComponentLink1Description: Digikey; ComponentLink1URL: https://www.digikey.com.au/product-detail/en/w%C3%BCrth-elektronik/74404064221/732-7261-1-ND/5353241; ComponentLink2Description: LCSC A; ComponentLink2URL: https://lcsc.com/product-detail/Power-Inductors_Sunlord-SWPA6045S221MT_C91047.html; ComponentLink3Description: LCSC B; ComponentLink3URL: https://lcsc.com/product-detail/Power-Inductors_SXN-Shun-Xiang-Nuo-Elec-SMNR6045-221MT_C467145.html
R22 = 111k 1% 0603: Resistor, SMD, 111k, 0.1W, 1%, 0603
R23 = 1k 5% 0603: Resistor, SMD, 1k, 0.1W, 5%, 0603
R24 = 20k 1% 0603: Resistor, SMD, 20k, 0.1W, 1%, 0603

## Sheet SHDN-CURRENT-S12-V00-Buzzer.SchDoc: Alarm Buzzer (4kHz)
size A3; DrawnBy: Jonn Dillon; DocumentNumber: 12; SheetNumber: 12; SheetTotal: 14; Project: Shutdown Current Board 2020
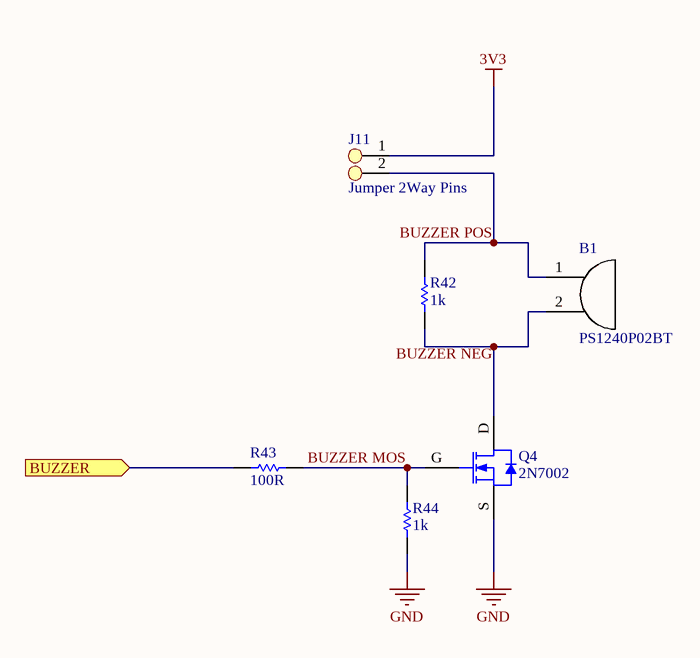
[diagram p10: SHDN-CURRENT-S12-V00-Buzzer.SchDoc]

### Parts
B1  PS1240P02BT  [PS1240P02BT]
J11  Jumper 2Way Pins  [Jumper_2Way_Pin]
Q4  2N7002  [SOT23-3]
R42  1k  [Res_ThinFilm_0603]
R43  100R  [Res_ThinFilm_0603]
R44  1k  [Res_ThinFilm_0603]

### Ports
BUZZER (in)

### Nets
3V3: J11.1
GND: Q4.S R44.2
BUZZER: R43.1 ; port BUZZER
BUZZER MOS: Q4.G R43.2 R44.1
BUZZER NEG: B1.2 Q4.D R42.1
BUZZER POS: B1.1 J11.2 R42.2

### Notes on the sheet
- Revision History:
- Sheet Title:
- Rev
- Date
- Description
- Project:
- Size:
- Drawn By:
- A3
- Number:
- Revision:
- Sheet
- Version:
- of
- QUT Motorsport
- O-120, Gardens Point
- 2 George Street
- Brisbane, QLD 4000
- Australia
- Print Date:
- Print Time:
- File Name:

### Library data of the parts
B1 = PS1240P02BT: Buzzers Transducer, Externally Driven Piezo 3V 4kHz 60dB @ 3V, 10cm Through Hole PC Pins
J11 = Jumper 2Way Side Pins
R42 R44 = 1k 5% 0603: Resistor, SMD, 1k, 0.1W, 5%, 0603
R43 = 100R 5%, 0603: Resistor, SMD, 100R, 0.1W, 5%, 0603

## Sheet SHDN-CURRENT-S13-V00-ShutdownRelay.SchDoc: Shutdown Loop Relay
size A3; DrawnBy: Jonn DIllon; DocumentNumber: 13; SheetNumber: 13; SheetTotal: 14; Project: Shutdown Current Board 2020
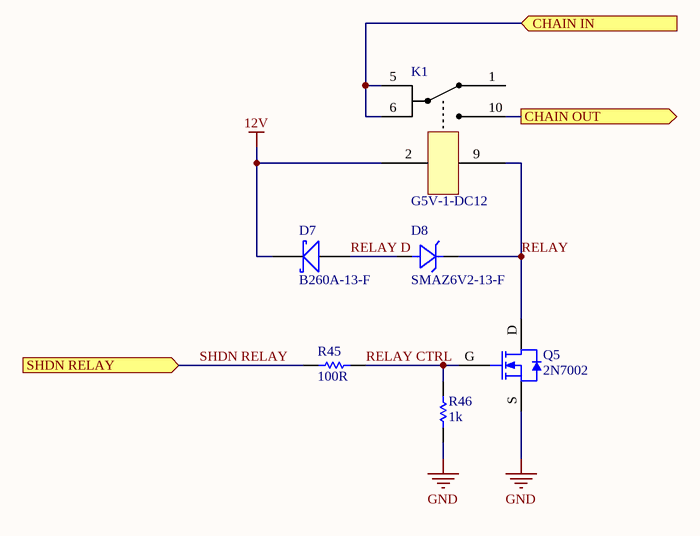
[diagram p11: SHDN-CURRENT-S13-V00-ShutdownRelay.SchDoc]

### Parts
D7  B260A-13-F  [SMA]
D8  SMAZ6V2-13-F  [SMA]
K1  G5V-1-DC12  [G5V-1]
Q5  2N7002  [SOT23-3]
R45  100R  [Res_ThinFilm_0603]
R46  1k  [Res_ThinFilm_0603]

### Ports
CHAIN IN (in), CHAIN OUT (out), SHDN RELAY (in)

### Nets
12V: D7.K K1.2
GND: Q5.S R46.1
CHAIN IN: K1.5 K1.6 ; port CHAIN IN
CHAIN OUT: K1.10 ; port CHAIN OUT
RELAY: D8.K(Cathode) K1.9 Q5.D
RELAY CTRL: Q5.G R45.2 R46.2
RELAY D: D7.A D8.A(Anode)
SHDN RELAY: R45.1 ; port SHDN RELAY  [project net 5kW ALERT]

Not connected (* = marked no-connect by the designer): K1 1

### Notes on the sheet
- Revision History:
- Sheet Title:
- Rev
- Date
- Description
- Project:
- Size:
- Drawn By:
- A3
- Number:
- Revision:
- Sheet
- Version:
- of
- QUT Motorsport
- O-120, Gardens Point
- 2 George Street
- Brisbane, QLD 4000
- Australia
- Print Date:
- Print Time:
- File Name:

### Library data of the parts
D7 = B260A-13-F: as D4 on sheet SHDN-CURRENT-S04-V00-PSU-3V3
D8 = SMAZ6V2-13-F: as D3 on sheet SHDN-CURRENT-S06-V00-5kWSimulation
K1 = G5V-1-DC12: General Purpose Relay SPDT (1 Form C) Through Hole, 12V, 2A
R45 = 100R 5%, 0603: Resistor, SMD, 100R, 0.1W, 5%, 0603
R46 = 1k 5% 0603: Resistor, SMD, 1k, 0.1W, 5%, 0603

## Sheet SHDN-CURRENT-S14-V00-Connector.SchDoc: External Connector Interface
size A3; DrawnBy: Jonn Dillon; DocumentNumber: 14; SheetNumber: 14; SheetTotal: 14; Project: Shutdown Current Board 2020
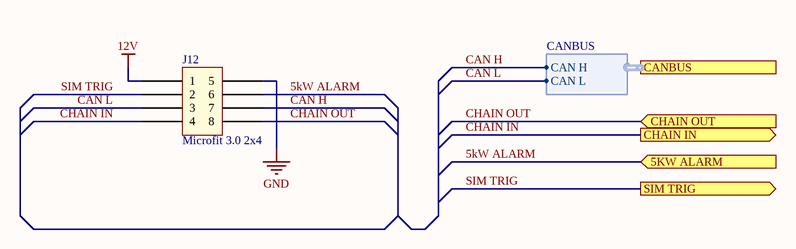
[diagram p12: SHDN-CURRENT-S14-V00-Connector.SchDoc]

### Parts
J12  Microfit 3.0 2x4  [Microfit_2X4_R_TH]

### Ports
5KW ALARM (in), CANBUS (harness CANBUS), CHAIN IN (out), CHAIN OUT (in), SIM TRIG (out)

### Harnesses
CANBUS: CAN H, CAN L

### Nets
12V: J12.1
GND: J12.5
5kW ALARM: J12.6 ; port 5KW ALARM
CAN H: J12.7 ; port CANBUS.CAN H
CAN L: J12.3 ; port CANBUS.CAN L
CHAIN IN: J12.4 ; port CHAIN IN
CHAIN OUT: J12.8 ; port CHAIN OUT
SIM TRIG: J12.2 ; port SIM TRIG

### Notes on the sheet
- Revision History:
- Sheet Title:
- Rev
- Date
- Description
- Project:
- Size:
- Drawn By:
- A3
- Number:
- Revision:
- Sheet
- Version:
- of
- QUT Motorsport
- O-120, Gardens Point
- 2 George Street
- Brisbane, QLD 4000
- Australia
- Print Date:
- Print Time:
- File Name:

### Library data of the parts
J12 = Microfit_2x4

## Nets that join several sheets
3V3: SHDN-CURRENT-S05-V00-CurrentInterface (J4.3), SHDN-CURRENT-S10-V00-5kWAlarm (J10.3), SHDN-CURRENT-S02-V00-Microcontroller (16 pins), SHDN-CURRENT-S04-V00-PSU-3V3 (6 pins), SHDN-CURRENT-S03-V00-IsolatedCAN (C13.2 J2.1 U3.3), SHDN-CURRENT-S12-V00-Buzzer (J11.1)
5V: SHDN-CURRENT-S05-V00-CurrentInterface (J4.4), SHDN-CURRENT-S10-V00-5kWAlarm (J10.4), SHDN-CURRENT-S09-V00-PSU-5V (5 pins)
12V: SHDN-CURRENT-S05-V00-CurrentInterface (J4.1), SHDN-CURRENT-S06-V00-5kWSimulation (J6.2), SHDN-CURRENT-S10-V00-5kWAlarm (J10.1), SHDN-CURRENT-S04-V00-PSU-3V3 (C19.2 C20.2 U6.4 U6.5), SHDN-CURRENT-S09-V00-PSU-5V (C24.2 U7.4 U7.5), SHDN-CURRENT-S13-V00-ShutdownRelay (D7.K K1.2), SHDN-CURRENT-S14-V00-Connector (J12.1)
GND: SHDN-CURRENT-S05-V00-CurrentInterface (J5.2 R8.1), SHDN-CURRENT-S06-V00-5kWSimulation (D2.A D3.A Q1.S R10.1), SHDN-CURRENT-S07-V00-LEMInterface (C14.1 C15.2 R12.1 U4.4), SHDN-CURRENT-S10-V00-5kWAlarm (R26.1 R29.1 R30.1 R31.1), SHDN-CURRENT-S08-V00-5kWDetection (7 pins), SHDN-CURRENT-S02-V00-Microcontroller (21 pins), SHDN-CURRENT-S04-V00-PSU-3V3 (8 pins), SHDN-CURRENT-S03-V00-IsolatedCAN (C13.1 D1.3 U3.2 U3.8), SHDN-CURRENT-S09-V00-PSU-5V (6 pins), SHDN-CURRENT-S12-V00-Buzzer (Q4.S R44.2), SHDN-CURRENT-S13-V00-ShutdownRelay (Q5.S R46.1), SHDN-CURRENT-S14-V00-Connector (J12.5)
LEM: SHDN-CURRENT-S05-V00-CurrentInterface (J4.2 J5.4 R7.2), SHDN-CURRENT-S07-V00-LEMInterface (C15.1 U4.8), SHDN-CURRENT-S08-V00-5kWDetection (C17.1 R16.2 R17.1 U5.8)
5kW ALARM: SHDN-CURRENT-S10-V00-5kWAlarm (Q2.S R31.2), SHDN-CURRENT-S14-V00-Connector (J12.6)
5kW ALERT: SHDN-CURRENT-S10-V00-5kWAlarm (R28.1), SHDN-CURRENT-S08-V00-5kWDetection (TP4.1 U5.1), SHDN-CURRENT-S02-V00-Microcontroller (U1.11), SHDN-CURRENT-S13-V00-ShutdownRelay (R45.1)
5kW CALIBRATION: SHDN-CURRENT-S08-V00-5kWDetection (6 pins), SHDN-CURRENT-S02-V00-Microcontroller (U1.10)
BUZZER: SHDN-CURRENT-S02-V00-Microcontroller (U1.41), SHDN-CURRENT-S12-V00-Buzzer (R43.1)
CAN H: SHDN-CURRENT-S03-V00-IsolatedCAN (D1.2 J3.1 U3.7), SHDN-CURRENT-S14-V00-Connector (J12.7)
CAN L: SHDN-CURRENT-S03-V00-IsolatedCAN (D1.1 R6.1 U3.6), SHDN-CURRENT-S14-V00-Connector (J12.3)
CAN RX: SHDN-CURRENT-S02-V00-Microcontroller (U1.32), SHDN-CURRENT-S03-V00-IsolatedCAN (R5.1 U3.4)
CAN TX: SHDN-CURRENT-S02-V00-Microcontroller (U1.33), SHDN-CURRENT-S03-V00-IsolatedCAN (R4.1 U3.1)
CHAIN IN: SHDN-CURRENT-S13-V00-ShutdownRelay (K1.5 K1.6), SHDN-CURRENT-S14-V00-Connector (J12.4)
CHAIN OUT: SHDN-CURRENT-S13-V00-ShutdownRelay (K1.10), SHDN-CURRENT-S14-V00-Connector (J12.8)
CURRENT VLTG: SHDN-CURRENT-S07-V00-LEMInterface (C14.2 R15.2 TP1.1 U4.7), SHDN-CURRENT-S08-V00-5kWDetection (U5.2), SHDN-CURRENT-S02-V00-Microcontroller (U1.12)
LEM REF: SHDN-CURRENT-S05-V00-CurrentInterface (J5.1), SHDN-CURRENT-S07-V00-LEMInterface (TP2.1 U4.2)
LEM SIG: SHDN-CURRENT-S05-V00-CurrentInterface (J5.3), SHDN-CURRENT-S07-V00-LEMInterface (TP3.1 U4.6)
SIM TRIG: SHDN-CURRENT-S06-V00-5kWSimulation (D2.K R9.1), SHDN-CURRENT-S14-V00-Connector (J12.2)
VSEL ALARM: SHDN-CURRENT-S10-V00-5kWAlarm (R27.1 R29.2), SHDN-CURRENT-S02-V00-Microcontroller (U1.14)
VSEL LEM: SHDN-CURRENT-S05-V00-CurrentInterface (R7.1 R8.2), SHDN-CURRENT-S02-V00-Microcontroller (U1.13)